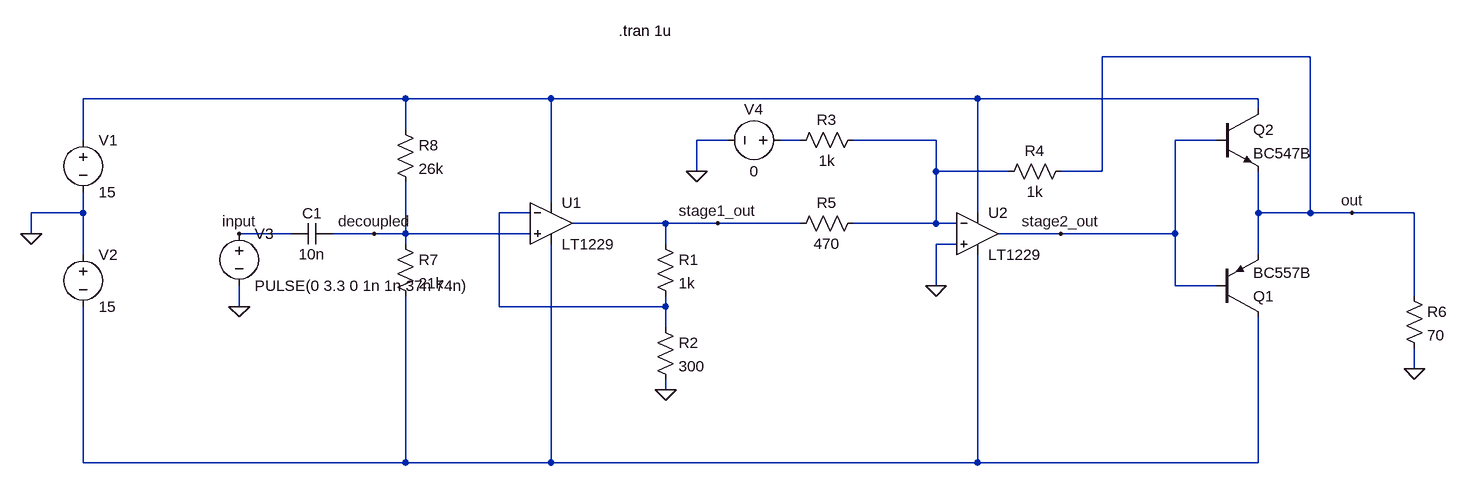
[diagram p0: schematic LT1229_amp.asc]
LT1229_amp.asc, the LTspice schematic file:
Version 4
SHEET 1 1416 680
WIRE 1200 -192 880 -192
WIRE -192 -128 -688 -128
WIRE 32 -128 -192 -128
WIRE 688 -128 32 -128
WIRE 1120 -128 688 -128
WIRE 1120 -112 1120 -128
WIRE -192 -80 -192 -128
WIRE -688 -64 -688 -128
WIRE 304 -64 256 -64
WIRE 416 -64 384 -64
WIRE 624 -64 496 -64
WIRE 1056 -64 992 -64
WIRE 256 -16 256 -64
WIRE 624 -16 624 -64
WIRE 736 -16 624 -16
WIRE 880 -16 880 -192
WIRE 880 -16 816 -16
WIRE 32 32 32 -128
WIRE -688 48 -688 16
WIRE -688 48 -768 48
WIRE 0 48 -48 48
WIRE 688 48 688 -128
WIRE 1120 48 1120 -16
WIRE 1200 48 1200 -192
WIRE 1200 48 1120 48
WIRE 1264 48 1200 48
WIRE 1360 48 1264 48
WIRE 208 64 64 64
WIRE 288 64 208 64
WIRE 416 64 288 64
WIRE 624 64 624 -16
WIRE 624 64 496 64
WIRE 656 64 624 64
WIRE -768 80 -768 48
WIRE -368 80 -448 80
WIRE -240 80 -304 80
WIRE -192 80 -192 0
WIRE -192 80 -240 80
WIRE 0 80 -192 80
WIRE 816 80 720 80
WIRE 992 80 992 -64
WIRE 992 80 816 80
WIRE -192 96 -192 80
WIRE 208 96 208 64
WIRE 656 96 624 96
WIRE -688 112 -688 48
WIRE 1120 112 1120 48
WIRE 624 160 624 96
WIRE 992 160 992 80
WIRE 1056 160 992 160
WIRE 1360 176 1360 48
WIRE -448 192 -448 160
WIRE -48 192 -48 48
WIRE 208 192 208 176
WIRE 208 192 -48 192
WIRE 208 224 208 192
WIRE 1360 288 1360 256
WIRE 208 320 208 304
WIRE -688 432 -688 192
WIRE -192 432 -192 176
WIRE -192 432 -688 432
WIRE 32 432 32 96
WIRE 32 432 -192 432
WIRE 688 432 688 112
WIRE 688 432 32 432
WIRE 1120 432 1120 208
WIRE 1120 432 688 432
FLAG -768 80 0
FLAG -448 192 0
FLAG -448 80 input
FLAG 288 64 stage1_out
FLAG 208 320 0
FLAG 624 160 0
FLAG 256 -16 0
FLAG 816 80 stage2_out
FLAG 1360 288 0
FLAG 1264 48 out
FLAG -240 80 decoupled
SYMBOL Opamps\\LT1229 32 0 R0
SYMATTR InstName U1
SYMBOL voltage -688 -80 R0
WINDOW 123 0 0 Left 2
WINDOW 39 0 0 Left 2
SYMATTR InstName V1
SYMATTR Value 15
SYMBOL voltage -688 96 R0
WINDOW 123 0 0 Left 2
WINDOW 39 0 0 Left 2
SYMATTR InstName V2
SYMATTR Value 15
SYMBOL voltage -448 64 R0
WINDOW 123 0 0 Left 2
WINDOW 39 0 0 Left 2
SYMATTR InstName V3
SYMATTR Value PULSE(0 3.3 0 1n 1n 37n 74n)
SYMBOL res 192 80 R0
SYMATTR InstName R1
SYMATTR Value 1k
SYMBOL res 192 208 R0
SYMATTR InstName R2
SYMATTR Value 300
SYMBOL Opamps\\LT1229 688 16 R0
SYMATTR InstName U2
SYMBOL res 832 -32 R90
WINDOW 0 0 56 VBottom 2
WINDOW 3 32 56 VTop 2
SYMATTR InstName R4
SYMATTR Value 1k
SYMBOL res 512 48 R90
WINDOW 0 0 56 VBottom 2
WINDOW 3 32 56 VTop 2
SYMATTR InstName R5
SYMATTR Value 470
SYMBOL res 512 -80 R90
WINDOW 0 0 56 VBottom 2
WINDOW 3 32 56 VTop 2
SYMATTR InstName R3
SYMATTR Value 1k
SYMBOL voltage 400 -64 R90
WINDOW 0 -32 56 VBottom 2
WINDOW 3 32 56 VTop 2
WINDOW 123 0 0 Left 2
WINDOW 39 0 0 Left 2
SYMATTR InstName V4
SYMATTR Value 0
SYMBOL pnp 1056 208 M180
SYMATTR InstName Q1
SYMATTR Value BC557B
SYMBOL npn 1056 -112 R0
SYMATTR InstName Q2
SYMATTR Value BC547B
SYMBOL res 1344 160 R0
SYMATTR InstName R6
SYMATTR Value 70
SYMBOL cap -304 64 R90
WINDOW 0 0 32 VBottom 2
WINDOW 3 32 32 VTop 2
SYMATTR InstName C1
SYMATTR Value 10n
SYMBOL res -208 80 R0
SYMATTR InstName R7
SYMATTR Value 21k
SYMBOL res -208 -96 R0
SYMATTR InstName R8
SYMATTR Value 26k
TEXT 136 -232 Left 2 !.tran 1u

The netlist it stands for:
* LT1229_amp.asc
XU1 decoupled N004 N001 N005 stage1_out LT1229  ; pins In+ In- V+ V- OUT
V1 N001 0 15
V2 0 N005 15
V3 input 0 PULSE(0 3.3 0 1n 1n 37n 74n)
R1 stage1_out N004 1k
R2 N004 0 300
XU2 0 N003 N001 N005 stage2_out LT1229  ; pins In+ In- V+ V- OUT
R4 out N003 1k
R5 N003 stage1_out 470
R3 N003 N002 1k
V4 N002 0 0
Q1 N005 stage2_out out 0 BC557B
Q2 N001 stage2_out out 0 BC547B
R6 out 0 70
C1 decoupled input 10n
R7 decoupled N005 21k
R8 N001 decoupled 26k
.model NPN NPN
.model PNP PNP
.lib standard.bjt
.tran 1u
.backanno
.end